# EAGLE schematic Stimulation_Testbed_Core_V1 (EAGLE 7.5.0)

## Sheet 1 of 3
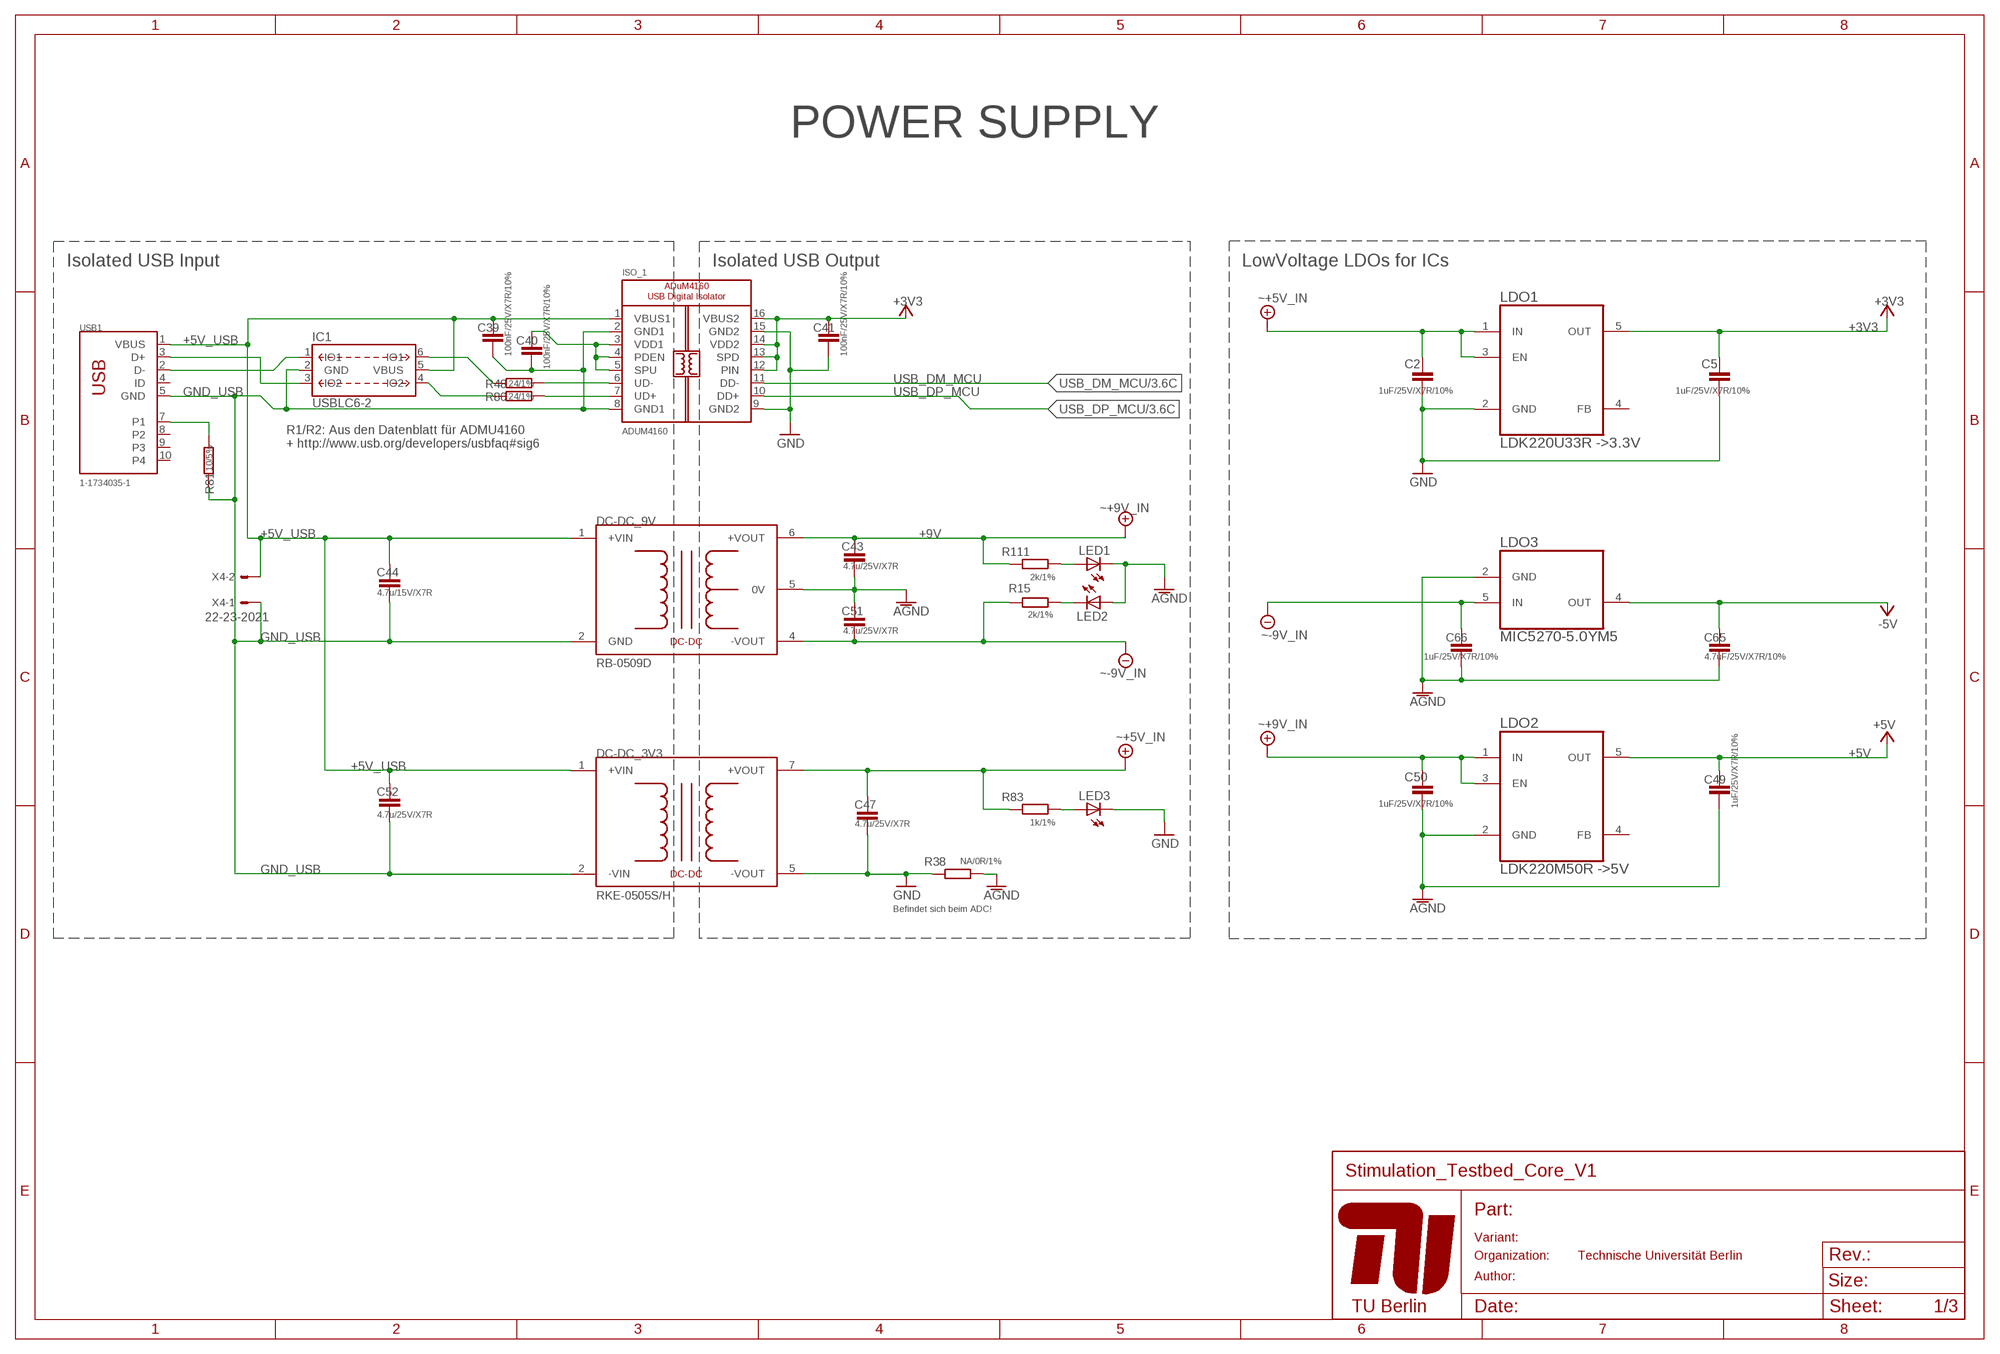
[diagram p0: schematic, sheet 1]

### Parts
C2  1uF/25V/X7R/10%  C-EUC0603K  [C0603K]
C5  1uF/25V/X7R/10%  C-EUC0603K  [C0603K]
C39  100nF/25V/X7R/10%  C-EUC0603K  [C0603K]
C40  100nF/25V/X7R/10%  C-EUC0603K  [C0603K]
C41  100nF/25V/X7R/10%  C-EUC0603K  [C0603K]
C43  4.7u/25V/X7R  C-EUC0603  [C0603]
C44  4.7u/15V/X7R  C-EUC0603  [C0603]
C47  4.7u/25V/X7R  C-EUC0603  [C0603]
C49  1uF/25V/X7R/10%  C-EUC0603K  [C0603K]
C50  1uF/25V/X7R/10%  C-EUC0603K  [C0603K]
C51  4.7u/25V/X7R  C-EUC0603  [C0603]
C52  4.7u/25V/X7R  C-EUC0603  [C0603]
C65  4.7uF/25V/X7R/10%  C-EUC0603K  [C0603K]
C66  1uF/25V/X7R/10%  C-EUC0603K  [C0603K]
DC-DC_3V3  RKE-0505S/H  MEJ2S0503SC  [MEJ2]
DC-DC_9V  RB-0509D  NMH0509SC  [NMH]
IC1  USBLC6-2  [SOT-23-6]
ISO_1  ADUM4160  ADMU4160  [SOIC16WIDE]
LDO1  LDK220U33R ->3.3V  LDK220  [SOT-23-5]
LDO2  LDK220M50R ->5V  LDK220  [SOT-23-5]
LDO3  MIC5270-5.0YM5  MIC5270-X.X  [SOT-23-5]
LED1  LEDCHIPLED_0603  [CHIPLED_0603]
LED2  LEDCHIPLED_0603  [CHIPLED_0603]
LED3  LEDCHIPLED_0603  [CHIPLED_0603]
R15  2k/1%  R-EU_R0603  [R0603]
R38  NA/0R/1%  R-EU_R0603  [R0603]
R48  24/1%  R-EU_R0603  [R0603]
R80  24/1%  R-EU_R0603  [R0603]
R81  10/5%  R-EU_R0603  [R0603]
R83  1k/1%  R-EU_R0603  [R0603]
R111  2k/1%  R-EU_R0603  [R0603]
USB1  1-1734035-1  [TE_1-1734035-1]
X4  22-23-2021  [22-23-2021]

### Nets
+3V3: C5.1 C41.1 ISO_1.12(PIN) ISO_1.13(SPD) ISO_1.14(VDD2) ISO_1.16(VBUS2) LDO1.5(OUT) ; also sheet 2,3
+5V: C49.1 LDO2.5(OUT) ; also sheet 2,3
+5V_IN: C2.1 C47.1 DC-DC_3V3.7(+VOUT) LDO1.1(IN) LDO1.3(EN) R83.1 ; supply symbol labelled ~+5V_IN
+5V_USB: C39.1 C44.1 C52.1 DC-DC_3V3.1(+VIN) DC-DC_9V.1(+VIN) IC1.5(VBUS) ISO_1.1(VBUS1) USB1.1(VBUS) X4.2
+9V: C43.1 C50.1 DC-DC_9V.6(+VOUT) LDO2.1(IN) LDO2.3(EN) R111.1 ; supply symbol labelled ~+9V_IN
-5V: C65.1 LDO3.4(OUT) ; also sheet 2
-9V: C51.2 C66.1 DC-DC_9V.4(-VOUT) LDO3.5(IN) R15.2 ; supply symbol labelled ~-9V_IN
AGND: C43.2 C49.2 C50.2 C51.1 C65.2 C66.2 DC-DC_9V.5(0V) LDO2.2(GND) LDO3.2(GND) LED1.C LED2.A R38.2 ; also sheet 2,3
GND: C2.2 C5.2 C41.2 C47.2 DC-DC_3V3.5(-VOUT) ISO_1.9(GND2) ISO_1.15(GND2) LDO1.2(GND) LED3.C R38.1 ; also sheet 2,3
GND_USB: C39.2 C40.2 C44.2 C52.2 DC-DC_3V3.2(-VIN) DC-DC_9V.2(GND) IC1.2(GND) ISO_1.2(GND1) ISO_1.8(GND1) R81.1 USB1.5(GND) X4.1
N$61: IC1.6(IO1) R48.1
N$71: C40.1 ISO_1.3(VDD1) ISO_1.4(PDEN) ISO_1.5(SPU)
N$73: ISO_1.6(UD-) R48.2
N$74: ISO_1.7(UD+) R80.2
N$75: R81.2 USB1.7(P1)
N$78: LED2.C R15.1
N$86: LED3.A R83.2
N$107: LED1.A R111.2
N$114: IC1.3(IO2) USB1.3(D+)
N$115: IC1.1(IO1) USB1.2(D-)
N$116: IC1.4(IO2) R80.1
USB_DM_MCU: ISO_1.11(DD-) ; also sheet 3
USB_DP_MCU: ISO_1.10(DD+) ; also sheet 3
Unconnected: LDO1.4(FB) LDO2.4(FB) USB1.4(ID) USB1.8(P2) USB1.9(P3) USB1.10(P4)

### Notes on the sheet
- POWER SUPPLY
- Isolated USB Input | Isolated USB Output | LowVoltage LDOs for ICs
- R1/R2: Aus den Datenblatt für ADMU4160
  + http://www.usb.org/developers/usbfaq#sig6
- Befindet sich beim ADC!

## Sheet 2 of 3
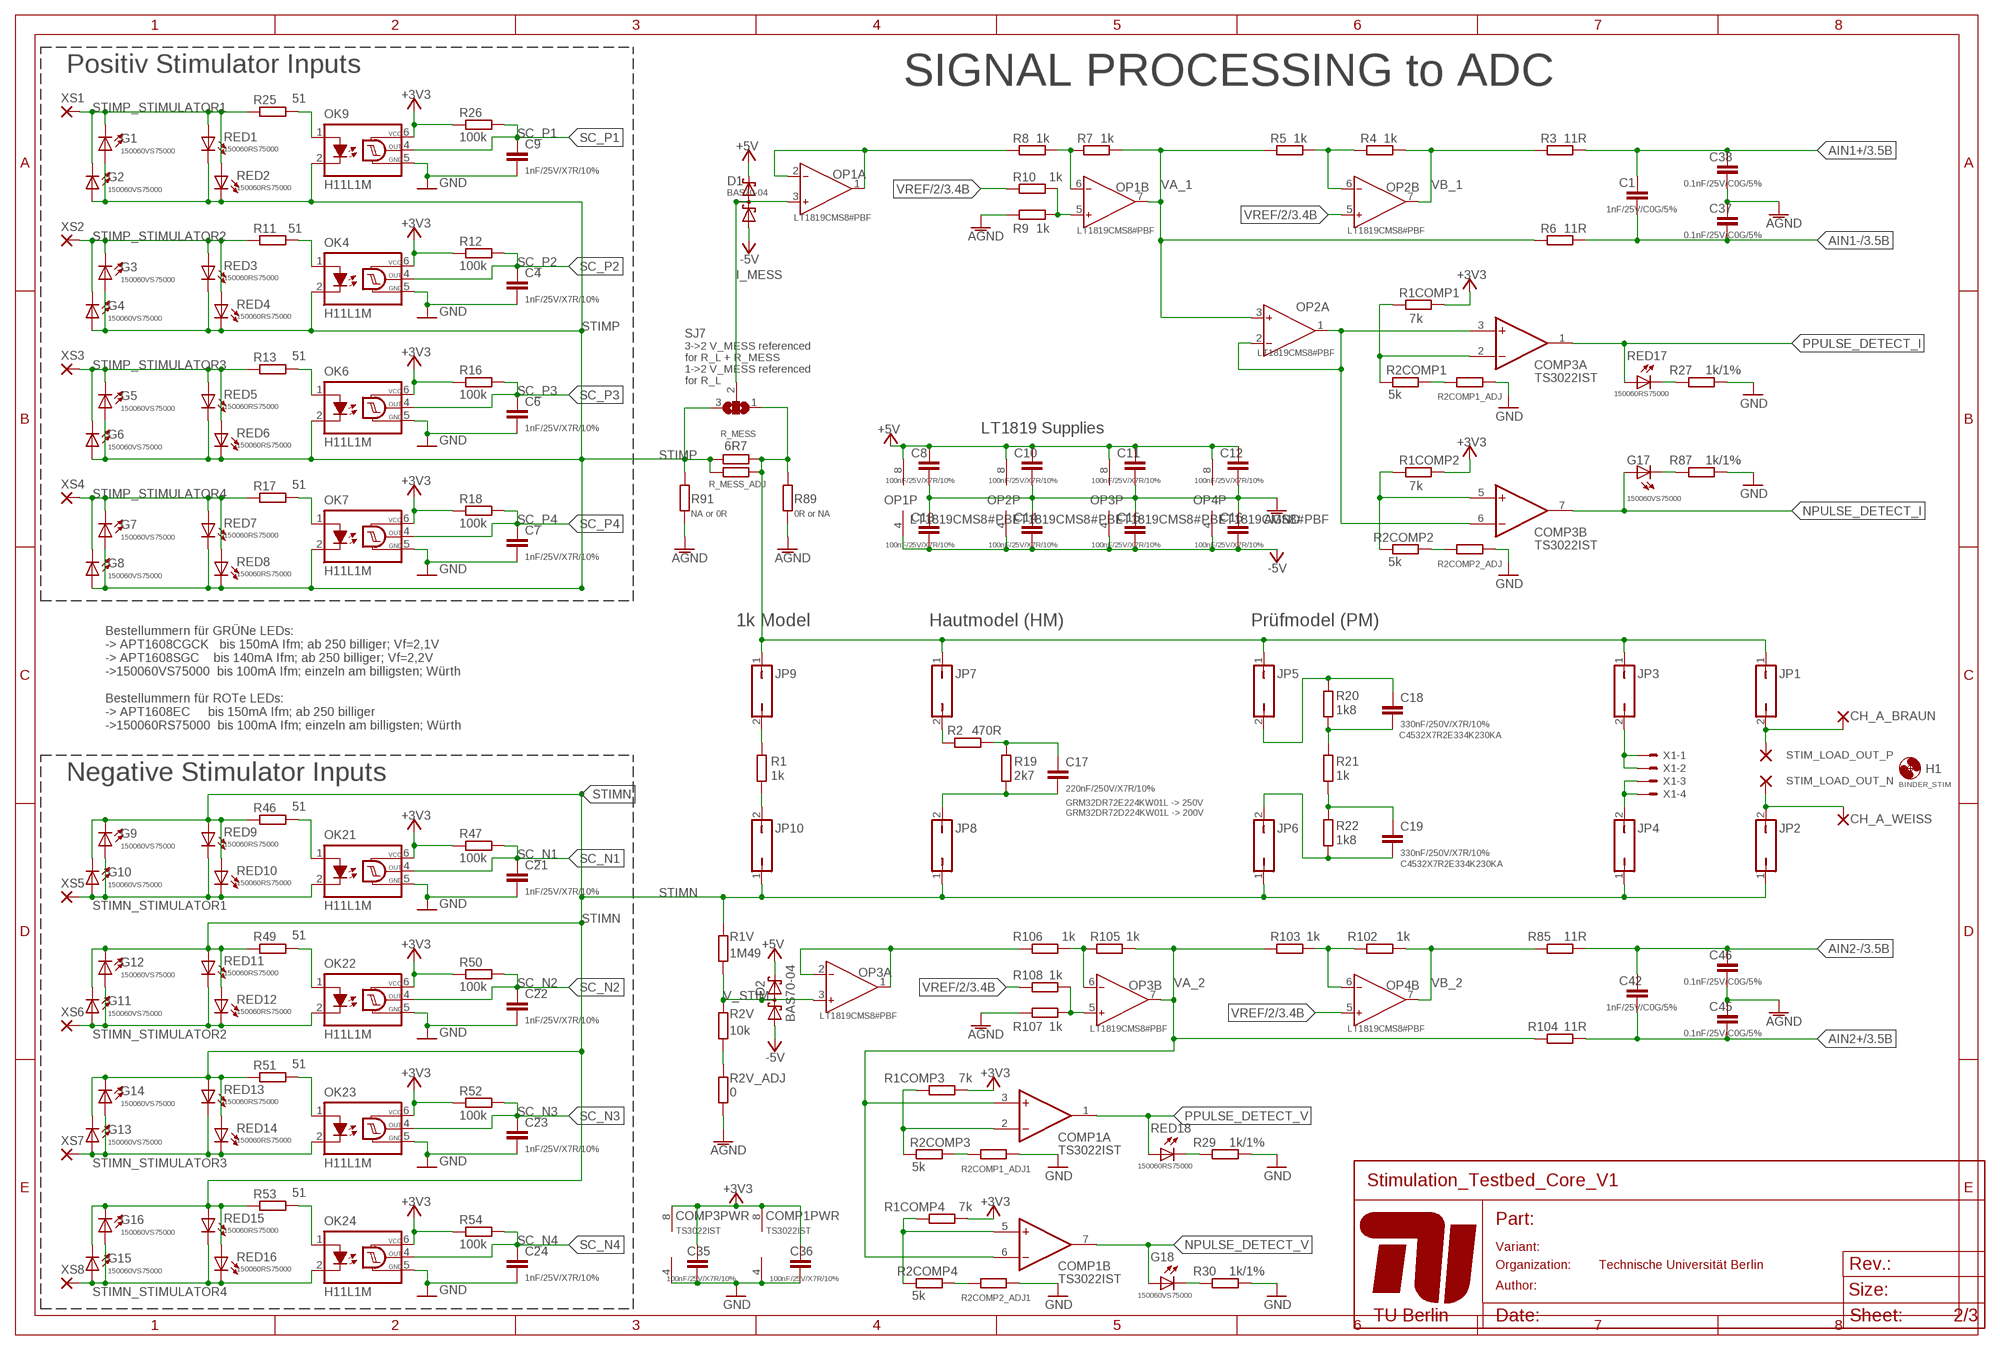
[diagram p1: schematic, sheet 2]

### Parts
C1  1nF/25V/C0G/5%  C-EUC0603K  [C0603K]
C4  1nF/25V/X7R/10%  C-EUC0603  [C0603]
C6  1nF/25V/X7R/10%  C-EUC0603  [C0603]
C7  1nF/25V/X7R/10%  C-EUC0603  [C0603]
C8  100nF/25V/X7R/10%  C-EUC0603K  [C0603K]
C9  1nF/25V/X7R/10%  C-EUC0603  [C0603]
C10  100nF/25V/X7R/10%  C-EUC0603K  [C0603K]
C11  100nF/25V/X7R/10%  C-EUC0603K  [C0603K]
C12  100nF/25V/X7R/10%  C-EUC0603K  [C0603K]
C13  100nF/25V/X7R/10%  C-EUC0603K  [C0603K]
C14  100nF/25V/X7R/10%  C-EUC0603K  [C0603K]
C15  100nF/25V/X7R/10%  C-EUC0603K  [C0603K]
C16  100nF/25V/X7R/10%  C-EUC0603K  [C0603K]
C17  220nF/250V/X7R/10%  C-EUC1210  [C1210]
C18  330nF/250V/X7R/10%  C-EUC1812  [C1812]
C19  330nF/250V/X7R/10%  C-EUC1812  [C1812]
C21  1nF/25V/X7R/10%  C-EUC0603  [C0603]
C22  1nF/25V/X7R/10%  C-EUC0603  [C0603]
C23  1nF/25V/X7R/10%  C-EUC0603  [C0603]
C24  1nF/25V/X7R/10%  C-EUC0603  [C0603]
C35  100nF/25V/X7R/10%  C-EUC0603K  [C0603K]
C36  100nF/25V/X7R/10%  C-EUC0603K  [C0603K]
C37  0.1nF/25V/C0G/5%  C-EUC0603K  [C0603K]
C38  0.1nF/25V/C0G/5%  C-EUC0603K  [C0603K]
C42  1nF/25V/C0G/5%  C-EUC0603K  [C0603K]
C45  0.1nF/25V/C0G/5%  C-EUC0603K  [C0603K]
C46  0.1nF/25V/C0G/5%  C-EUC0603K  [C0603K]
CH_A_BRAUN  1,6/0,8  [1,6/0,8]
CH_A_WEISS  1,6/0,8  [1,6/0,8]
COMP1  TS3022IST  [MSOP8]
COMP3  TS3022IST  [MSOP8]
D1  BAS70-04  [SOT23]
D2  BAS70-04  [SOT23]
G1  150060VS75000  LEDCHIPLED_0603  [CHIPLED_0603]
G2  150060VS75000  LEDCHIPLED_0603  [CHIPLED_0603]
G3  150060VS75000  LEDCHIPLED_0603  [CHIPLED_0603]
G4  150060VS75000  LEDCHIPLED_0603  [CHIPLED_0603]
G5  150060VS75000  LEDCHIPLED_0603  [CHIPLED_0603]
G6  150060VS75000  LEDCHIPLED_0603  [CHIPLED_0603]
G7  150060VS75000  LEDCHIPLED_0603  [CHIPLED_0603]
G8  150060VS75000  LEDCHIPLED_0603  [CHIPLED_0603]
G9  150060VS75000  LEDCHIPLED_0603  [CHIPLED_0603]
G10  150060VS75000  LEDCHIPLED_0603  [CHIPLED_0603]
G11  150060VS75000  LEDCHIPLED_0603  [CHIPLED_0603]
G12  150060VS75000  LEDCHIPLED_0603  [CHIPLED_0603]
G13  150060VS75000  LEDCHIPLED_0603  [CHIPLED_0603]
G14  150060VS75000  LEDCHIPLED_0603  [CHIPLED_0603]
G15  150060VS75000  LEDCHIPLED_0603  [CHIPLED_0603]
G16  150060VS75000  LEDCHIPLED_0603  [CHIPLED_0603]
G17  150060VS75000  LEDCHIPLED_0603  [CHIPLED_0603]
G18  150060VS75000  LEDCHIPLED_0603  [CHIPLED_0603]
H1  BINDER_STIM  [5,5-PAD]
JP1  JP1Q  [JP1]
JP2  JP1Q  [JP1]
JP3  JP1Q  [JP1]
JP4  JP1Q  [JP1]
JP5  JP1Q  [JP1]
JP6  JP1Q  [JP1]
JP7  JP1Q  [JP1]
JP8  JP1Q  [JP1]
JP9  JP1Q  [JP1]
JP10  JP1Q  [JP1]
OK4  H11L1M  [DIL06]
OK6  H11L1M  [DIL06]
OK7  H11L1M  [DIL06]
OK9  H11L1M  [DIL06]
OK21  H11L1M  [DIL06]
OK22  H11L1M  [DIL06]
OK23  H11L1M  [DIL06]
OK24  H11L1M  [DIL06]
OP1  LT1819CMS8#PBF  LT1819  [MSOP8]
OP2  LT1819CMS8#PBF  LT1819  [MSOP8]
OP3  LT1819CMS8#PBF  LT1819  [MSOP8]
OP4  LT1819CMS8#PBF  LT1819  [MSOP8]
R1  1k  R-EU_R1206  [R1206]
R1COMP1  7k  R-EU_R0603  [R0603]
R1COMP2  7k  R-EU_R0603  [R0603]
R1COMP3  7k  R-EU_R0603  [R0603]
R1COMP4  7k  R-EU_R0603  [R0603]
R1V  1M49  R-EU_R1206  [R1206]
R2  470R  R-EU_R1206  [R1206]
R2COMP1  5k  R-EU_R0603  [R0603]
R2COMP1_ADJ  R-EU_R0603  [R0603]
R2COMP1_ADJ1  R-EU_R0603  [R0603]
R2COMP2  5k  R-EU_R0603  [R0603]
R2COMP2_ADJ  1k  R-EU_R0603  [R0603]
R2COMP2_ADJ1  1k  R-EU_R0603  [R0603]
R2COMP3  5k  R-EU_R0603  [R0603]
R2COMP4  5k  R-EU_R0603  [R0603]
R2V  10k  R-EU_R1206  [R1206]
R2V_ADJ  0  R-EU_R1206  [R1206]
R3  11R  R-EU_R0603  [R0603]
R4  1k  R-EU_R0603  [R0603]
R5  1k  R-EU_R0603  [R0603]
R6  11R  R-EU_R0603  [R0603]
R7  1k  R-EU_R0603  [R0603]
R8  1k  R-EU_R0603  [R0603]
R9  1k  R-EU_R0603  [R0603]
R10  1k  R-EU_R0603  [R0603]
R11  51  R-EU_R0603  [R0603]
R12  100k  R-EU_R0603  [R0603]
R13  51  R-EU_R0603  [R0603]
R16  100k  R-EU_R0603  [R0603]
R17  51  R-EU_R0603  [R0603]
R18  100k  R-EU_R0603  [R0603]
R19  2k7  R-EU_R1206  [R1206]
R20  1k8  R-EU_R1206  [R1206]
R21  1k  R-EU_R1206  [R1206]
R22  1k8  R-EU_R1206  [R1206]
R25  51  R-EU_R0603  [R0603]
R26  100k  R-EU_R0603  [R0603]
R27  1k/1%  R-EU_R0603  [R0603]
R29  1k/1%  R-EU_R0603  [R0603]
R30  1k/1%  R-EU_R0603  [R0603]
R46  51  R-EU_R0603  [R0603]
R47  100k  R-EU_R0603  [R0603]
R49  51  R-EU_R0603  [R0603]
R50  100k  R-EU_R0603  [R0603]
R51  51  R-EU_R0603  [R0603]
R52  100k  R-EU_R0603  [R0603]
R53  51  R-EU_R0603  [R0603]
R54  100k  R-EU_R0603  [R0603]
R85  11R  R-EU_R0603  [R0603]
R87  1k/1%  R-EU_R0603  [R0603]
R89  0R or NA  R-EU_R0603  [R0603]
R91  NA or 0R  R-EU_R0603  [R0603]
R102  1k  R-EU_R0603  [R0603]
R103  1k  R-EU_R0603  [R0603]
R104  11R  R-EU_R0603  [R0603]
R105  1k  R-EU_R0603  [R0603]
R106  1k  R-EU_R0603  [R0603]
R107  1k  R-EU_R0603  [R0603]
R108  1k  R-EU_R0603  [R0603]
R_MESS  6R7  R-EU_R1206  [R1206]
R_MESS_ADJ  R-EU_R1206  [R1206]
RED1  150060RS75000  LEDCHIP-LED0603  [CHIP-LED0603]
RED2  150060RS75000  LEDCHIP-LED0603  [CHIP-LED0603]
RED3  150060RS75000  LEDCHIP-LED0603  [CHIP-LED0603]
RED4  150060RS75000  LEDCHIP-LED0603  [CHIP-LED0603]
RED5  150060RS75000  LEDCHIP-LED0603  [CHIP-LED0603]
RED6  150060RS75000  LEDCHIP-LED0603  [CHIP-LED0603]
RED7  150060RS75000  LEDCHIP-LED0603  [CHIP-LED0603]
RED8  150060RS75000  LEDCHIP-LED0603  [CHIP-LED0603]
RED9  150060RS75000  LEDCHIP-LED0603  [CHIP-LED0603]
RED10  150060RS75000  LEDCHIP-LED0603  [CHIP-LED0603]
RED11  150060RS75000  LEDCHIP-LED0603  [CHIP-LED0603]
RED12  150060RS75000  LEDCHIP-LED0603  [CHIP-LED0603]
RED13  150060RS75000  LEDCHIP-LED0603  [CHIP-LED0603]
RED14  150060RS75000  LEDCHIP-LED0603  [CHIP-LED0603]
RED15  150060RS75000  LEDCHIP-LED0603  [CHIP-LED0603]
RED16  150060RS75000  LEDCHIP-LED0603  [CHIP-LED0603]
RED17  150060RS75000  LEDCHIP-LED0603  [CHIP-LED0603]
RED18  150060RS75000  LEDCHIP-LED0603  [CHIP-LED0603]
SJ7  SJ2W  [SJ_2]
STIM_LOAD_OUT_N  3,81/1,4  [3,81/1,4]
STIM_LOAD_OUT_P  3,81/1,4  [3,81/1,4]
X1  22-23-2041  [22-23-2041]
XS1  WIREPAD3,81/1,4  [3,81/1,4]
XS2  WIREPAD3,81/1,4  [3,81/1,4]
XS3  WIREPAD3,81/1,4  [3,81/1,4]
XS4  WIREPAD3,81/1,4  [3,81/1,4]
XS5  WIREPAD3,81/1,4  [3,81/1,4]
XS6  WIREPAD3,81/1,4  [3,81/1,4]
XS7  WIREPAD3,81/1,4  [3,81/1,4]
XS8  WIREPAD3,81/1,4  [3,81/1,4]

### Nets
2XVREF: OP3.1(A:OUT) OP3.2(A:IN-) R106.2
2XVREF1: OP1.1(A:OUT) OP1.2(A:IN-) R8.2
+3V3: C35.1 C36.1 COMP1.8(PWR:V+) COMP3.8(PWR:V+) OK4.6(VCC) OK6.6(VCC) OK7.6(VCC) OK9.6(VCC) OK21.6(VCC) OK22.6(VCC) OK23.6(VCC) OK24.6(VCC) R1COMP1.1 R1COMP2.1 R1COMP3.1 R1COMP4.1 R12.1 R16.1 R18.1 R26.1 R47.1 R50.1 R52.1 R54.1 ; also sheet 1,3
+5V: C8.1 C10.1 C11.1 C12.1 D1.2(C2) D2.2(C2) OP1.8(P:V+) OP2.8(P:V+) OP3.8(P:V+) OP4.8(P:V+) ; also sheet 1,3
-5V: C13.2 C14.2 C15.2 C16.2 D1.1(A1) D2.1(A1) OP1.4(P:V-) OP2.4(P:V-) OP3.4(P:V-) OP4.4(P:V-) ; also sheet 1
AGND: C8.2 C10.2 C11.2 C12.2 C13.1 C14.1 C15.1 C16.1 C37.2 C38.1 C45.2 C46.1 R2V_ADJ.2 R9.2 R89.2 R91.2 R107.2 ; also sheet 1,3
AIN1+: C1.2 C38.2 R3.1 ; also sheet 3
AIN1-: C1.1 C37.1 R6.2 ; also sheet 3
AIN2+: C42.1 C45.1 R104.2 ; also sheet 3
AIN2-: C42.2 C46.2 R85.1 ; also sheet 3
GND: C4.2 C6.2 C7.2 C9.2 C21.2 C22.2 C23.2 C24.2 C35.2 C36.2 COMP1.4(PWR:V-) COMP3.4(PWR:V-) OK4.5(GND) OK6.5(GND) OK7.5(GND) OK9.5(GND) OK21.5(GND) OK22.5(GND) OK23.5(GND) OK24.5(GND) R2COMP1_ADJ1.1 R2COMP1_ADJ.1 R2COMP2_ADJ1.1 R2COMP2_ADJ.1 R27.1 R29.1 R30.1 R87.1 ; also sheet 1,3
I_MESS: D1.3(C1A2) OP1.3(A:IN+) SJ7.2
N$1: OK4.1(A) R11.1
N$2: R2COMP2.2 R2COMP2_ADJ.2
N$6: R29.2 RED18.C
N$7: G18.C R30.2
N$8: COMP1.2(A:-IN) R1COMP3.2 R2COMP3.1
N$9: COMP1.5(B:+IN) R1COMP4.2 R2COMP4.1
N$10: G17.C R87.2
N$11: OP1.5(B:IN+) R9.1 R10.1
N$12: R2COMP1_ADJ1.2 R2COMP3.2
N$13: R2COMP2_ADJ1.2 R2COMP4.2
N$14: OK6.1(A) R13.1
N$16: OK7.1(A) R17.1
N$17: OK9.1(A) R25.1
N$24: OP1.6(B:IN-) R7.2 R8.1
N$27: OP2.6(B:IN-) R4.2 R5.1
N$28: COMP3.3(A:+IN) COMP3.6(B:-IN) OP2.1(A:OUT) OP2.2(A:IN-)
N$30: OK21.1(A) R46.1
N$31: COMP3.2(A:-IN) R1COMP1.2 R2COMP1.1
N$32: CH_A_WEISS.1(P) JP2.2 STIM_LOAD_OUT_N.1(P)
N$34: OK22.1(A) R49.1
N$35: OK23.1(A) R51.1
N$36: OK24.1(A) R53.1
N$51: R2V.1 R2V_ADJ.1
N$52: OP3.5(B:IN+) R107.1 R108.1
N$54: CH_A_BRAUN.1(P) JP1.2 STIM_LOAD_OUT_P.1(P)
N$55: JP3.2 X1.1 X1.2
N$56: JP9.2 R1.1
N$57: JP4.2 X1.3 X1.4
N$58: JP10.2 R1.2
N$59: JP7.2 R2.2
N$60: OP3.6(B:IN-) R105.2 R106.1
N$62: C17.1 JP8.2 R19.2
N$63: C19.2 R21.2 R22.1
N$64: C19.1 JP6.2 R22.2
N$65: C18.2 JP5.2 R20.1
N$66: C18.1 R20.2 R21.1
N$68: OP4.6(B:IN-) R102.2 R103.1
N$70: C17.2 R2.1 R19.1
N$97: R27.2 RED17.C
N$99: COMP3.5(B:+IN) R1COMP2.2 R2COMP2.1
N$104: R2COMP1.2 R2COMP1_ADJ.2
NPULSE_DETECT_I: COMP3.7(B:OUT) G17.A ; also sheet 3
NPULSE_DETECT_V: COMP1.7(B:OUT) G18.A ; also sheet 3
PPULSE_DETECT_I: COMP3.1(A:OUT) RED17.A ; also sheet 3
PPULSE_DETECT_V: COMP1.1(A:OUT) RED18.A ; also sheet 3
SC_N1: C21.1 OK21.4(OUT) R47.2 ; also sheet 3
SC_N2: C22.1 OK22.4(OUT) R50.2 ; also sheet 3
SC_N3: C23.1 OK23.4(OUT) R52.2 ; also sheet 3
SC_N4: C24.1 OK24.4(OUT) R54.2 ; also sheet 3
SC_P1: C9.1 OK9.4(OUT) R26.2 ; also sheet 3
SC_P2: C4.1 OK4.4(OUT) R12.2 ; also sheet 3
SC_P3: C6.1 OK6.4(OUT) R16.2 ; also sheet 3
SC_P4: C7.1 OK7.4(OUT) R18.2 ; also sheet 3
STIMN: G9.C G10.C G11.C G12.C G13.C G14.C G15.C G16.C JP2.1 JP4.1 JP6.1 JP8.1 JP10.1 R1V.2 R46.2 R49.2 R51.2 R53.2 RED9.A RED10.A RED11.A RED12.A RED13.A RED14.A RED15.A RED16.A ; also sheet 3
STIMN_STIMULATOR1: G9.A G10.A OK21.2(C) RED9.C RED10.C XS5.1(P)
STIMN_STIMULATOR2: G11.A G12.A OK22.2(C) RED11.C RED12.C XS6.1(P)
STIMN_STIMULATOR3: G13.A G14.A OK23.2(C) RED13.C RED14.C XS7.1(P)
STIMN_STIMULATOR4: G15.A G16.A OK24.2(C) RED15.C RED16.C XS8.1(P)
STIMP: G1.A G2.A G3.A G4.A G5.A G6.A G7.A G8.A OK4.2(C) OK6.2(C) OK7.2(C) OK9.2(C) R91.1 R_MESS.2 R_MESS_ADJ.1 RED1.C RED2.C RED3.C RED4.C RED5.C RED6.C RED7.C RED8.C SJ7.3 ; also sheet 3
STIMP_MODEL: JP1.1 JP3.1 JP5.1 JP7.1 JP9.1 R89.1 R_MESS.1 R_MESS_ADJ.2 SJ7.1
STIMP_STIMULATOR1: G1.C G2.C R25.2 RED1.A RED2.A XS1.1(P)
STIMP_STIMULATOR2: G3.C G4.C R11.2 RED3.A RED4.A XS2.1(P)
STIMP_STIMULATOR3: G5.C G6.C R13.2 RED5.A RED6.A XS3.1(P)
STIMP_STIMULATOR4: G7.C G8.C R17.2 RED7.A RED8.A XS4.1(P)
V_STIM: D2.3(C1A2) OP3.3(A:IN+) R1V.1 R2V.2
VA_1: OP1.7(B:OUT) OP2.3(A:IN+) R5.2 R6.1 R7.1
VA_2: COMP1.3(A:+IN) COMP1.6(B:-IN) OP3.7(B:OUT) R103.2 R104.1 R105.1
VB_1: OP2.7(B:OUT) R3.2 R4.1
VB_2: OP4.7(B:OUT) R85.2 R102.1
VREF/2: OP2.5(B:IN+) OP4.5(B:IN+) R10.2 R108.2 ; also sheet 3

### Notes on the sheet
- Positiv Stimulator Inputs
- SIGNAL PROCESSING to ADC
- 3->2 V_MESS referenced 
  for R_L + R_MESS
  1->2 V_MESS referenced 
  for R_L
- LT1819 Supplies
- 1k Model | Hautmodel (HM) | Prüfmodel (PM)
- Bestellummern für GRÜNe LEDs:
  -> APT1608CGCK   bis 150mA Ifm; ab 250 billiger; Vf=2,1V
  -> APT1608SGC    bis 140mA Ifm; ab 250 billiger; Vf=2,2V
  ->150060VS75000  bis 100mA Ifm; einzeln am billigsten; Würth
  
  Bestellummern für ROTe LEDs:
  -> APT1608EC     bis 150mA Ifm; ab 250 billiger
  ->150060RS75000  bis 100mA Ifm; einzeln am billigsten; Würth
- C4532X7R2E334K230KA
- Negative Stimulator Inputs
- GRM32DR72E224KW01L -> 250V
  GRM32DR72D224KW01L -> 200V
- C4532X7R2E334K230KA

## Sheet 3 of 3
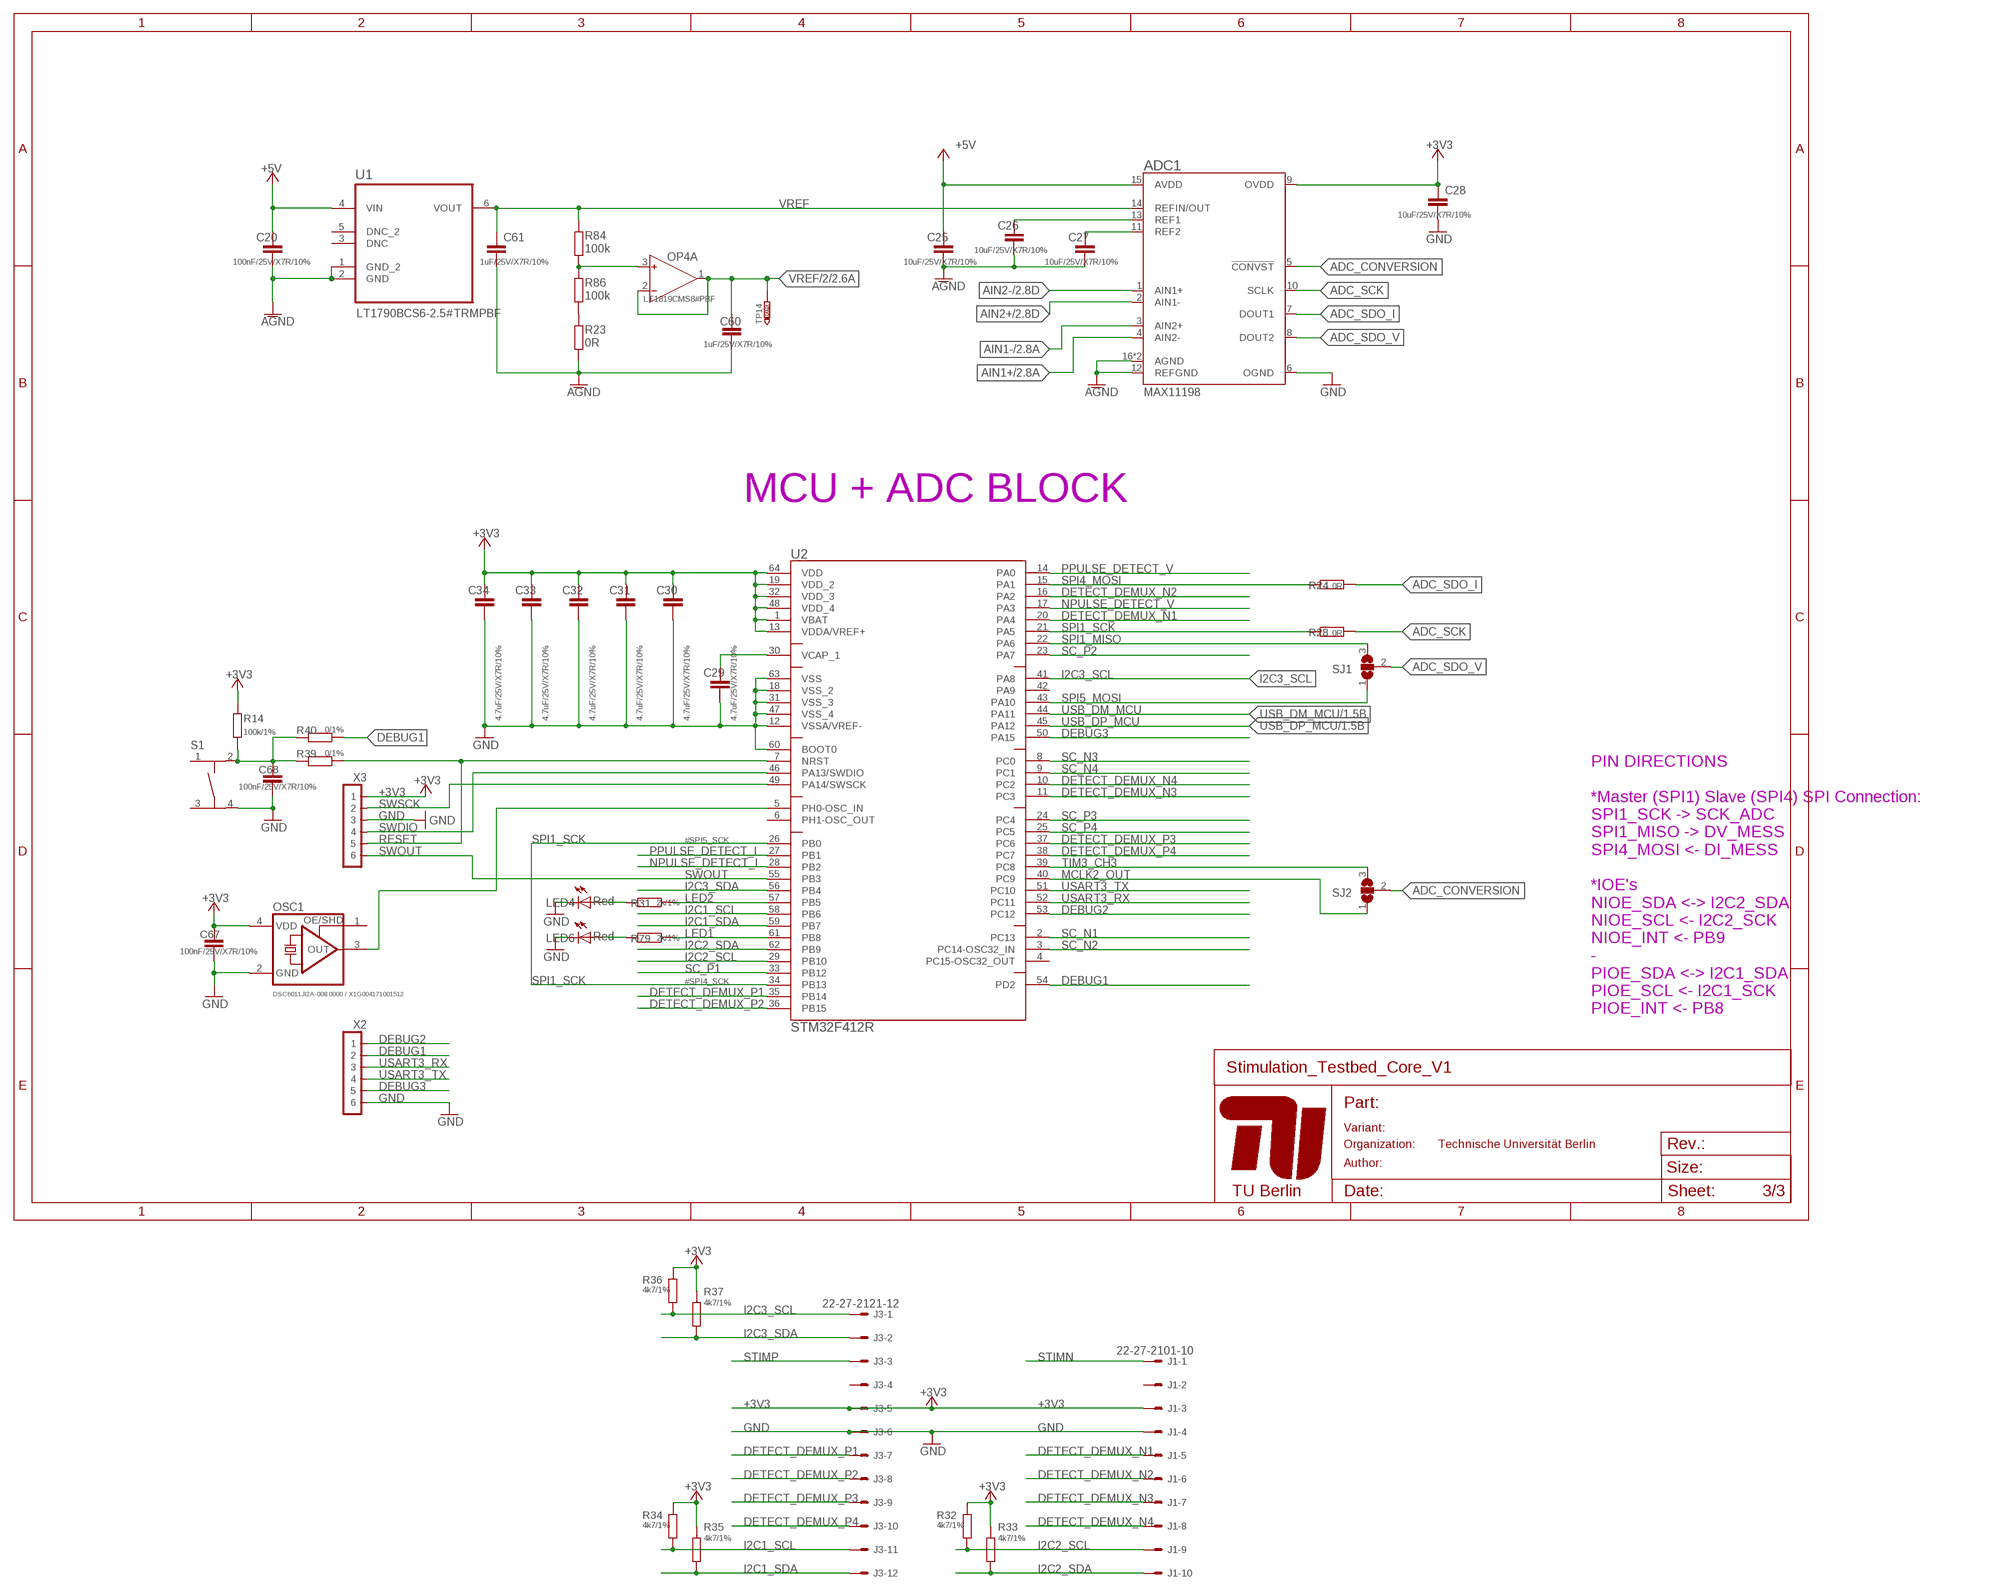
[diagram p2: schematic, sheet 3]

### Parts
ADC1  MAX11198  [T1623CN+1]
C20  100nF/25V/X7R/10%  C-EUC0603K  [C0603K]
C25  10uF/25V/X7R/10%  C-EUC0603K  [C0603K]
C26  10uF/25V/X7R/10%  C-EUC0603K  [C0603K]
C27  10uF/25V/X7R/10%  C-EUC0603K  [C0603K]
C28  10uF/25V/X7R/10%  C-EUC0603K  [C0603K]
C29  4.7uF/25V/X7R/10%  C-EUC0603K  [C0603K]
C30  4.7uF/25V/X7R/10%  C-EUC0603K  [C0603K]
C31  4.7uF/25V/X7R/10%  C-EUC0603K  [C0603K]
C32  4.7uF/25V/X7R/10%  C-EUC0603K  [C0603K]
C33  4.7uF/25V/X7R/10%  C-EUC0603K  [C0603K]
C34  4.7uF/25V/X7R/10%  C-EUC0603K  [C0603K]
C60  1uF/25V/X7R/10%  C-EUC0603K  [C0603K]
C61  1uF/25V/X7R/10%  C-EUC0603K  [C0603K]
C67  100nF/25V/X7R/10%  C-EUC0603K  [C0603K]
C68  100nF/25V/X7R/10%  C-EUC0603K  [C0603K]
J1  22-27-2101-10  [6410-10]
J3  22-27-2121-12  [6410-12]
LED4  Red  LEDCHIPLED_0603  [CHIPLED_0603]
LED6  Red  LEDCHIPLED_0603  [CHIPLED_0603]
OSC1  DSC6011JI2A-008.0000 / X1G004171001512  OSC60XXX2.5X2  [OSC_2.5X2]
R14  100k/1%  R-EU_R0603  [R0603]
R23  0R  R-EU_R0603  [R0603]
R24  0R  R-EU_R0603  [R0603]
R28  0R  R-EU_R0603  [R0603]
R31  2k/1%  R-EU_R0603  [R0603]
R32  4k7/1%  R-EU_R0603  [R0603]
R33  4k7/1%  R-EU_R0603  [R0603]
R34  4k7/1%  R-EU_R0603  [R0603]
R35  4k7/1%  R-EU_R0603  [R0603]
R36  4k7/1%  R-EU_R0603  [R0603]
R37  4k7/1%  R-EU_R0603  [R0603]
R39  0/1%  R-EU_R0603  [R0603]
R40  0/1%  R-EU_R0603  [R0603]
R79  2k/1%  R-EU_R0603  [R0603]
R84  100k  R-EU_R0603  [R0603]
R86  100k  R-EU_R0603  [R0603]
S1  TASTERSMD  [TAST_SMD]
SJ1  SJ2W  [SJ_2]
SJ2  SJ2W  [SJ_2]
TP14  TESTPOINT_TH  [TP1-09]
U1  LT1790BCS6-2.5#TRMPBF  LT1790ACS6-2.5PBF  [SOT95P280X100-6N]
U2  STM32F412R  STM32F4XXR  [LQFP64-10X10MM]
X2  PINHD-1X66X1.27  [1.27_1X06_S]
X3  PINHD-1X66X1.27  [1.27_1X06_S]

### Nets
+3V3: ADC1.9(OVDD) C28.1 C30.1 C31.1 C32.1 C33.1 C34.1 C67.1 J1.3 J3.5 OSC1.4(VDD) R14.2 R32.1 R33.1 R34.1 R35.1 R36.1 R37.1 U2.1(VBAT) U2.13(VDDA/VREF+) U2.19(VDD_2) U2.32(VDD_3) U2.48(VDD_4) U2.64(VDD) X3.P1 ; also sheet 1,2
+5V: ADC1.15(AVDD) C20.1 C25.1 U1.4(VIN) ; also sheet 1,2
ADC_CONVERSION: ADC1.5(!CONVST!) SJ2.2
ADC_SCK: ADC1.10(SCLK) R28.2
ADC_SDO_I: ADC1.7(DOUT1) R24.2
ADC_SDO_V: ADC1.8(DOUT2) SJ1.2
AGND: ADC1.12(REFGND) ADC1.16(AGND) ADC1.EXP(AGND) C20.2 C25.2 C26.2 C27.2 C60.2 C61.2 R23.2 U1.1(GND_2) U1.2(GND) ; also sheet 1,2
AIN1+: ADC1.4(AIN2-) ; also sheet 2
AIN1-: ADC1.3(AIN2+) ; also sheet 2
AIN2+: ADC1.2(AIN1-) ; also sheet 2
AIN2-: ADC1.1(AIN1+) ; also sheet 2
DEBUG1: R40.1 U2.54(PD2) X2.P2
DEBUG2: U2.53(PC12) X2.P1
DEBUG3: U2.50(PA15) X2.P5
DETECT_DEMUX_N1: J1.5 U2.20(PA4)
DETECT_DEMUX_N2: J1.6 U2.16(PA2)
DETECT_DEMUX_N3: J1.7 U2.11(PC3)
DETECT_DEMUX_N4: J1.8 U2.10(PC2)
DETECT_DEMUX_P1: J3.7 U2.35(PB14)
DETECT_DEMUX_P2: J3.8 U2.36(PB15)
DETECT_DEMUX_P3: J3.9 U2.37(PC6)
DETECT_DEMUX_P4: J3.10 U2.38(PC7)
GND: ADC1.6(OGND) C28.2 C29.2 C30.2 C31.2 C32.2 C33.2 C34.2 C67.2 C68.2 J1.4 J3.6 LED4.C LED6.C OSC1.2(GND) S1.4 U2.12(VSSA/VREF-) U2.18(VSS_2) U2.31(VSS_3) U2.47(VSS_4) U2.60(BOOT0) U2.63(VSS) X2.P6 X3.P3 ; also sheet 1,2
I2C1_SCL: J3.11 R34.2 U2.58(PB6)
I2C1_SDA: J3.12 R35.2 U2.59(PB7)
I2C2_SCL: J1.9 R32.2 U2.29(PB10)
I2C2_SDA: J1.10 R33.2 U2.62(PB9)
I2C3_SCL: J3.1 R36.2 U2.41(PA8)
I2C3_SDA: J3.2 R37.2 U2.56(PB4)
LED1: R79.1 U2.61(PB8)
LED2: R31.1 U2.57(PB5)
MCLK2_OUT: SJ2.1 U2.40(PC9)
N$3: LED4.A R31.2
N$4: C29.1 U2.30(VCAP_1)
N$5: R23.1 R86.1
N$15: C68.1 R14.1 R39.2 R40.2 S1.2
N$92: ADC1.11(REF2) C27.1
N$93: ADC1.13(REF1) C26.1
N$95: OP4.3(A:IN+) R84.2 R86.2
N$98: OSC1.3(OUT) U2.5(PH0-OSC_IN)
N$103: LED6.A R79.2
NPULSE_DETECT_I: U2.28(PB2) ; also sheet 2
NPULSE_DETECT_V: U2.17(PA3) ; also sheet 2
PPULSE_DETECT_I: U2.27(PB1) ; also sheet 2
PPULSE_DETECT_V: U2.14(PA0) ; also sheet 2
RESET: R39.1 U2.7(NRST) X3.P5
SC_N1: U2.2(PC13) ; also sheet 2
SC_N2: U2.3(PC14-OSC32_IN) ; also sheet 2
SC_N3: U2.8(PC0) ; also sheet 2
SC_N4: U2.9(PC1) ; also sheet 2
SC_P1: U2.33(PB12) ; also sheet 2
SC_P2: U2.23(PA7) ; also sheet 2
SC_P3: U2.24(PC4) ; also sheet 2
SC_P4: U2.25(PC5) ; also sheet 2
SPI1_MISO: SJ1.3 U2.22(PA6)
SPI1_SCK: R28.1 U2.21(PA5) U2.26(PB0) U2.34(PB13)
SPI4_MOSI: R24.1 U2.15(PA1)
SPI5_MOSI: SJ1.1 U2.43(PA10)
STIMN: J1.1 ; also sheet 2
STIMP: J3.3 ; also sheet 2
SWDIO: U2.46(PA13/SWDIO) X3.P4
SWOUT: U2.55(PB3) X3.P6
SWSCK: U2.49(PA14/SWSCK) X3.P2
TIM3_CH3: SJ2.3 U2.39(PC8)
USART3_RX: U2.52(PC11) X2.P3
USART3_TX: U2.51(PC10) X2.P4
USB_DM_MCU: U2.44(PA11) ; also sheet 1
USB_DP_MCU: U2.45(PA12) ; also sheet 1
VREF: ADC1.14(REFIN/OUT) C61.1 R84.1 U1.6(VOUT)
VREF/2: C60.1 OP4.1(A:OUT) OP4.2(A:IN-) TP14.TP ; also sheet 2
Unconnected: J1.2 J3.4 OSC1.1(TRI) S1.1 S1.3 U1.3(DNC) U1.5(DNC_2) U2.4(PC15-OSC32_OUT) U2.6(PH1-OSC_OUT) U2.42(PA9)

### Notes on the sheet
- MCU + ADC BLOCK
- #SPI5_SCK
- #SPI4_SCK
- PIN DIRECTIONS
  
  *Master (SPI1) Slave (SPI4) SPI Connection:
  SPI1_SCK -> SCK_ADC
  SPI1_MISO -> DV_MESS
  SPI4_MOSI <- DI_MESS
  
  *IOE's
  NIOE_SDA <-> I2C2_SDA
  NIOE_SCL <- I2C2_SCK
  NIOE_INT <- PB9
  -
  PIOE_SDA <-> I2C1_SDA
  PIOE_SCL <- I2C1_SCK
  PIOE_INT <- PB8

## Library data of the parts
ADC1 = MAX11198:MAX11198: Dual ADC MAX11198
C1 C17-C19 C37 C38 C42 C45 C46 C60 C61 = resistor:C-EU: CAPACITOR, European symbol
C2 C4-C16 C20-C36 C39-C41 C43 C44 C47 C49-C52 C65-C68 = rcl:C-EU: CAPACITOR, European symbol
CH_A_BRAUN CH_A_WEISS = wirepad:1,6/0,8: THROUGH-HOLE PAD
COMP1 COMP3 = Testbed:TS3022: Dual Compartor STM TS3022
D1 D2 = diode:BAS70-04: Silicon Schottky Diodes General-purpose diode for high-speed switching
DC-DC_3V3 = Testbed:MEJ2S0503SC
DC-DC_9V = Testbed:NMH0509SC
G1-G18 LED1-LED4 LED6 RED1-RED18 = led:LED: LED OSRAM: - CHIPLED LG R971, LG N971, LY N971, LG Q971, LY Q971, LO R971, LY R971 LH N974, LH R974 LS Q976, LO Q976, LY Q976 LO Q996 - Hyper CHIPLED LW Q18S LB Q993, LB Q99A, LB R99A - SideLED LS A670, LO A670, LY A670, LG A670, LP A670 LB A673, LV A673, LT A673, LW A673 LH A674 LY A675 LS A676, LA A676, LO A676, LY A676, LW A676 LS A679, LY A679, LG A679 - Hyper Micro SIDELED® LS Y876, LA Y876, LO Y876, LY Y876 LT Y87S - SmartLED LW L88C, LW L88S LB L89C, LB L89S, LG L890 LS L89K, LO L89K, LY L89K LS L896, LA L896, LO L896, LY L896 - TOPLED LS T670, LO T670, LY T670, LG T670, LP T670 LSG T670, LSP T670, LSY T670, LOP T670, LYG T670 LG T671, LOG T671, LSG T671 LB T673, LV T673, LT T673, LW T673 LH T674 LS T676, LA T676, LO T676, LY T676, LB T676, LH T676, LSB T676, LW T676 LB T67C, LV T67C, LT T67C, LS T67K, LO T67K, LY T67K, LW E67C LS E67B, LA E67B, LO E67B, LY E67B, LB E67C, LV E67C, LT E67C LW T67C LS T679, LY T679, LG T679 LS T770, LO T770, LY T770, LG T770, LP T770 LB T773, LV T773, LT T773, LW T773 LH T774 LS E675, LA E675, LY E675, LS T675 LS T776, LA T776, LO T776, LY T776, LB T776 LHGB T686 LT T68C, LB T68C - Hyper Mini TOPLED® LB M676 - Mini TOPLED Santana® LG M470 LS M47K, LO M47K, LY M47K Source: http://www.osram.convergy.de LUXEON: - LUMILED® LXK2-PW12-R00, LXK2-PW12-S00, LXK2-PW14-U00, LXK2-PW14-V00 LXK2-PM12-R00, LXK2-PM12-S00, LXK2-PM14-U00 LXK2-PE12-Q00, LXK2-PE12-R00, LXK2-PE12-S00, LXK2-PE14-T00, LXK2-PE14-U00 LXK2-PB12-K00, LXK2-PB12-L00, LXK2-PB12-M00, LXK2-PB14-N00, LXK2-PB14-P00, LXK2-PB14-Q00 LXK2-PR12-L00, LXK2-PR12-M00, LXK2-PR14-Q00, LXK2-PR14-R00 LXK2-PD12-Q00, LXK2-PD12-R00, LXK2-PD12-S00 LXK2-PH12-R00, LXK2-PH12-S00 LXK2-PL12-P00, LXK2-PL12-Q00, LXK2-PL12-R00 Source: www.luxeon.com KINGBRIGHT: KA-3528ASYC Source: www.kingbright.com
H1 = Testbed:BINDER_STIM: Hole for the Binder Stimulation Connector Size: 6.3mm
IC1 = RehaDemux:USBLC6-2: USBLC6-2 Very low capacitance ESD protection The USBLC6-2SC6 is a monolithic application specific device dedicated to ESD protection of high speed interfaces, such as USB 2.0, Ethernet links and video lines. Its very low line capacitance secures a high level of signal integrity without compromising in protecting sensitive chips against the most stringent characterized ESD strikes. Key Features: 2 data-line protection -> Signal geht über den IC Protects VBUS Very low capacitance: 3 pF typ. Peak pulse power (8/20 μs): 130 W typ. SOT23-6L package RoHS compliant http://www.st.com/en/protection-devices/usblc6-2.html
ISO_1 = RehaDemux:ADMU4160: ADuM4160 Digital USB Isolator Website: http://www.analog.com/en/products/interface-isolation/isolation/standard-digital-isolators/adum4160.html <http://www.analog.com/en/products/interface-isolation/isolation/standard-digital-isolators/adum4160.html#product-overview>
J1 = con-molex:22-?-10: CONNECTOR wire to board 2.54 mm (.1 inch) pitch header; OC_FARNELL: unknown; OC_NEWARK: unknown
J3 = con-molex:22-?-12: CONNECTOR wire to board 2.54 mm (.1 inch) pitch header; OC_FARNELL: unknown; OC_NEWARK: unknown
JP1-JP10 = jumper:JP1Q: JUMPER
LDO1 LDO2 = RehaDemux:LDK220: ST 200 mA low quiescent current and low noise LDO fixed value or adjustable max. 200mA http://www.st.com/content/st_com/en/products/power-management/linear-voltage-regulators/low-dropout-ldo-linear-regulators/ultra-low-dropout-ldo-regulators/ldk220.html
LDO3 = RehaDemux:MIC5270-X.X: Negative LDO Voltage Regulator - MIC270-x.x
OK4 OK6 OK7 OK9 OK21-OK24 = optocoupler:H11L*M: 6-Pin DIP Optocoupler Source: http://www.fairchildsemi.com/ds/H1/H11L2-M.pdf; MF: FAIRCHILD SEMICONDUCTOR; MPN: H11L1-M; OC_FARNELL: 1021127; OC_NEWARK: 72K8643
OP1-OP4 = Testbed:LT1819: LT1819 400MHz OPV http://www.analog.com/media/en/technical-documentation/data-sheets/18189fb.pdf
OSC1 = RehaDemux:OSC60XXX: CMOS SMD CRYSTAL CLOCK OSCILLATOR DSC60XX:; OC_FARNELL: unknown; OC_NEWARK: unknown
R1 R1COMP1-R1COMP4 R1V R2 R2COMP1 R2COMP1_ADJ R2COMP1_ADJ1 R2COMP2 R2COMP2_ADJ R2COMP2_ADJ1 R2COMP3 R2COMP4 R2V R2V_ADJ R3-R13 R16-R23 R25-R27 R29 R30 R46 R47 R49-R54 R84-R87 R89 R91 R102-R108 R_MESS R_MESS_ADJ = resistor:R-EU_: RESISTOR, European symbol
R14 R15 R24 R28 R31-R40 R48 R79-R81 R83 R111 = rcl:R-EU_: RESISTOR, European symbol
S1 = RehaDemux:TASTER: Taster - 6mm x 6mm
SJ1 SJ2 SJ7 = jumper:SJ2W: SMD solder JUMPER
STIM_LOAD_OUT_N STIM_LOAD_OUT_P = wirepad:3,81/1,4: THROUGH-HOLE PAD
TP14 = RehaDemux:TESTPOINT: Testpoint
U1 = LT1790ACS6-2.5PBF:LT1790ACS6-2.5PBF: Micropower Low Dropout Reference Family; AVAILABILITY: Unavailable; DESCRIPTION: Voltage reference 2.5V SOT-23-6; MF: Linear Technology; MP: LT1790ACS6-2.5#PBF; PACKAGE: SOT-23-6 Linear Technology; PRICE: 2.91 USD
U2 = Testbed:STM32F4XXR; MANUFACTURER_PART_NUMBER: stm32f4xxr2; VENDOR: STMicroelectronics
USB1 = Testbed:1-1734035-1: CONN MINI B USB R/A SMD; CENTERLINE_PITCH: .8 mm[.031 in]; COMMENT: 1-1734035-1; DESCRIPTION: Mini USB,R/A,SMT,B Type,pbFree; DIGI-KEY_PART_NUMBER: A123089-ND; DIGI-KEY_PURCHASE_URL: https://www.digikey.de/product-detail/en/te-connectivity-amp-connectors/1-1734035-1/A123089-ND/954005?utm_source=snapeda&utm_medium=aggregator&utm_campaign=symbol; MF: TE Connectivity; MP: 1-1734035-1; NUMBER_OF_POSITIONS: 5; PACKAGE: None; PRODUCT_TYPE: Connector
X1 = con-molex:22-23-2041: .100" (2.54mm) Center Header - 4 Pin; MF: MOLEX; MPN: 22-23-2041; OC_FARNELL: 1462920; OC_NEWARK: 38C0355
X2 X3 = _PinHeader:PINHD-1X6
X4 = con-molex:22-23-2021: .100" (2.54mm) Center Header - 2 Pin; MF: MOLEX; MPN: 22-23-2021; OC_FARNELL: 1462926; OC_NEWARK: 25C3832
XS1-XS8 = wirepad:WIREPAD: Wire PAD connect wire on PCB